# EAGLE design Controller_daughter (EAGLE 7.7.0)
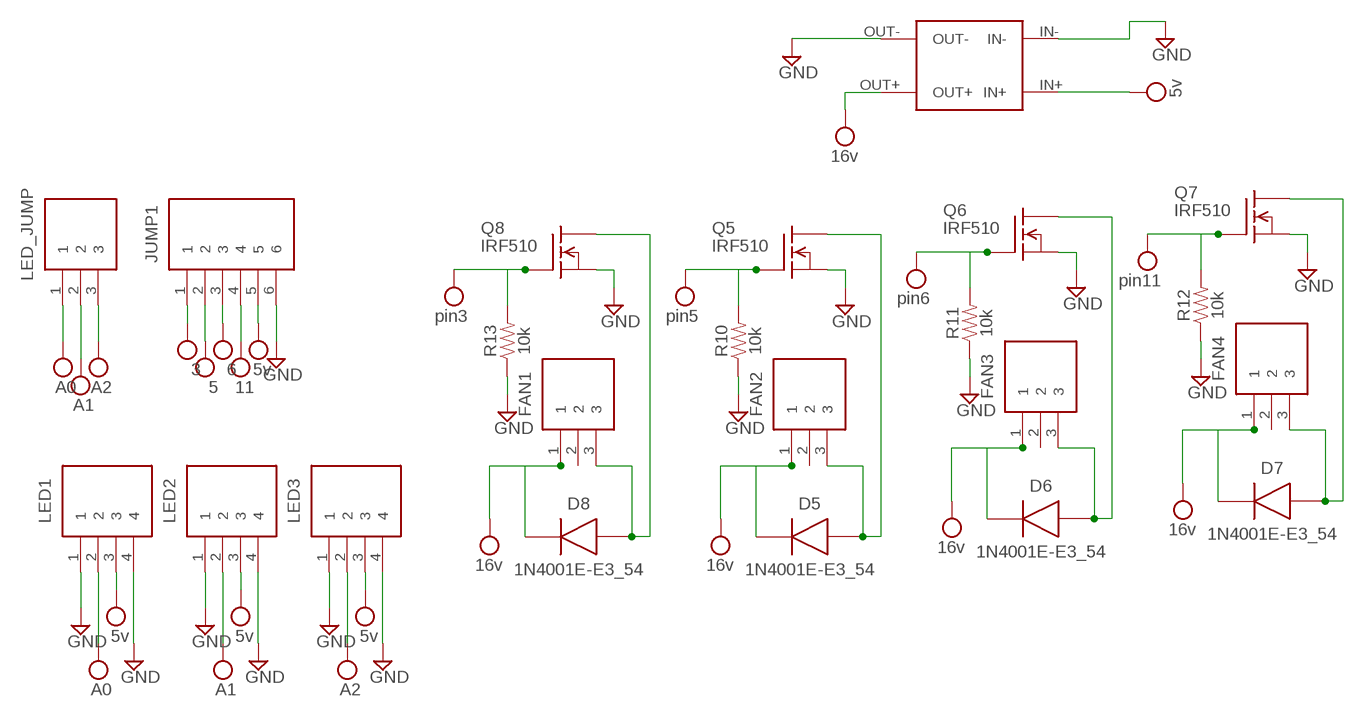
[diagram p0: schematic, sheet 1]

## Parts
D5  1N4001E-E3_54  [DIOAD1405W86L465D235]
D6  1N4001E-E3_54  [DIOAD1405W86L465D235]
D7  1N4001E-E3_54  [DIOAD1405W86L465D235]
D8  1N4001E-E3_54  [DIOAD1405W86L465D235]
FAN1  S3B-XH-A(LF)(SN)  [SHDR3W80P0X250_1X3_990X610X700]
FAN2  S3B-XH-A(LF)(SN)  [SHDR3W80P0X250_1X3_990X610X700]
FAN3  S3B-XH-A(LF)(SN)  [SHDR3W80P0X250_1X3_990X610X700]
FAN4  S3B-XH-A(LF)(SN)  [SHDR3W80P0X250_1X3_990X610X700]
JUMP1  S6B-XH-A(LF)(SN)  [SHDR6W64P0X250_1X6_1740X1155X7]
LED1  S4B-XH-A(LF)(SN)  [SHDR4W64P0X250_1X4_1240X1155X7]
LED2  S4B-XH-A(LF)(SN)  [SHDR4W64P0X250_1X4_1240X1155X7]
LED3  S4B-XH-A(LF)(SN)  [SHDR4W64P0X250_1X4_1240X1155X7]
LED_JUMP  S3B-XH-A(LF)(SN)  [SHDR3W80P0X250_1X3_990X610X700]
Q5  IRF510  [TO220]
Q6  IRF510  [TO220]
Q7  IRF510  [TO220]
Q8  IRF510  [TO220]
R10  10k  10KOHM-HORIZ-1/4W-5%  [AXIAL-0.3]
R11  10k  10KOHM-HORIZ-1/4W-5%  [AXIAL-0.3]
R12  10k  10KOHM-HORIZ-1/4W-5%  [AXIAL-0.3]
R13  10k  10KOHM-HORIZ-1/4W-5%  [AXIAL-0.3]
U$2  CN6009THROUGH_HOLE  [CN6009]

## Nets
5V_EXT: JUMP1.5 LED1.3 LED2.3 LED3.3 U$2.IN+ ; supply symbol labelled 5v
16V: D5.2(K) D6.2(K) D7.2(K) D8.2(K) FAN1.1 FAN2.1 FAN3.1 FAN4.1 U$2.OUT+ ; supply symbol labelled 16v
GND: JUMP1.6 LED1.1 LED1.4 LED2.1 LED2.4 LED3.1 LED3.4 U$2.IN-
GND_16: Q5.3(S) Q6.3(S) Q7.3(S) Q8.3(S) R10.P$1 R11.P$1 R12.P$1 R13.P$1 U$2.OUT- ; supply symbol labelled GND
N$5: D5.1(A) FAN2.3 Q5.2(D)
N$6: D6.1(A) FAN3.3 Q6.2(D)
N$7: D7.1(A) FAN4.3 Q7.2(D)
N$8: D8.1(A) FAN1.3 Q8.2(D)
PIN3: JUMP1.1 Q8.1(G) R13.P$2 ; supply symbol labelled pin3, 3
PIN5: JUMP1.2 Q5.1(G) R10.P$2 ; supply symbol labelled pin5, 5
PIN6: JUMP1.3 Q6.1(G) R11.P$2 ; supply symbol labelled pin6, 6
PIN11: JUMP1.4 Q7.1(G) R12.P$2 ; supply symbol labelled pin11, 11
PIN_A0: LED1.2 LED_JUMP.1 ; supply symbol labelled A0
PIN_A1: LED2.2 LED_JUMP.2 ; supply symbol labelled A1
PIN_A2: LED3.2 LED_JUMP.3 ; supply symbol labelled A2
Unconnected: FAN1.2 FAN2.2 FAN3.2 FAN4.2

## Library data of the parts
D5-D8 = SamacSys_Parts:1N4001E-E3_54: Rectifiers Vr/50V Io/1A <https://componentsearchengine.com/Images/1/1N4001E-E3_54.jpg> Source: Datasheet <http://www.vishay.com/docs/88503/1n4001.pdf>; DESCRIPTION: Rectifiers Vr/50V Io/1A; HEIGHT: mm; MANUFACTURER_NAME: Vishay; MANUFACTURER_PART_NUMBER: 1N4001E-E3/54; SUPPLIER_NAME: RS
FAN1-FAN4 LED_JUMP = SamacSys_Parts:S3B-XH-A(LF)(SN): XH-2.5mm Header side entry 3 way JST XH Series, Series Number S3B, 2.5mm Pitch 3 Way 1 Row Right Angle PCB Header, Solder Termination, 3A <https://componentsearchengine.com/Images/3/S3B-XH-A%28LF%29%28SN%29.jpg> Source: Datasheet <http://www.jst-mfg.com/product/pdf/eng/eXH.pdf>; DESCRIPTION: XH-2.5mm Header side entry 3 way JST XH Series, Series Number S3B, 2.5mm Pitch 3 Way 1 Row Right Angle PCB Header, Solder Termination, 3A; HEIGHT: 7mm; MANUFACTURER_NAME: JST (JAPAN SOLDERLESS TERMINALS); MANUFACTURER_PART_NUMBER: S3B-XH-A(LF)(SN); RS_PART_NUMBER: 8201585; SUPPLIER_NAME: RS
JUMP1 = SamacSys_Parts:S6B-XH-A(LF)(SN): XH-2.5mm Header side entry 6 way JST XH Series, Series Number S6B, 2.5mm Pitch 6 Way 1 Row Right Angle PCB Header, Solder Termination, 3A <https://componentsearchengine.com/Images/3/S6B-XH-A%28LF%29%28SN%29.jpg> Source: Datasheet <http://www.jst-mfg.com/product/pdf/eng/eXH.pdf>; DESCRIPTION: XH-2.5mm Header side entry 6 way JST XH Series, Series Number S6B, 2.5mm Pitch 6 Way 1 Row Right Angle PCB Header, Solder Termination, 3A; HEIGHT: 7mm; MANUFACTURER_NAME: JST (JAPAN SOLDERLESS TERMINALS); MANUFACTURER_PART_NUMBER: S6B-XH-A(LF)(SN); RS_PART_NUMBER: 8201591; SUPPLIER_NAME: RS
LED1-LED3 = SamacSys_Parts:S4B-XH-A(LF)(SN): XH-2.5mm Header side entry 4 way JST XH Series, Series Number S4B, 2.5mm Pitch 4 Way 1 Row Right Angle PCB Header, Solder Termination, 3A <https://componentsearchengine.com/Images/3/S4B-XH-A%28LF%29%28SN%29.jpg> Source: Datasheet <http://www.jst-mfg.com/product/pdf/eng/eXH.pdf>; DESCRIPTION: XH-2.5mm Header side entry 4 way JST XH Series, Series Number S4B, 2.5mm Pitch 4 Way 1 Row Right Angle PCB Header, Solder Termination, 3A; HEIGHT: 7mm; MANUFACTURER_NAME: JST (JAPAN SOLDERLESS TERMINALS); MANUFACTURER_PART_NUMBER: S4B-XH-A(LF)(SN); RS_PART_NUMBER: 8201589; SUPPLIER_NAME: RS
Q5-Q8 = transistor-fet:IRF510: N-Channel Enhancement MOSFET (HEXFET); 100V; 5,6A; 0,54Ohm
R10-R13 = SparkFun-Resistors:10KOHM: 10kΩ resistor A resistor is a passive two-terminal electrical component that implements electrical resistance as a circuit element. Resistors act to reduce current flow, and, at the same time, act to lower voltage levels within circuits. - Wikipedia; PROD_ID: RES-09435
U$2 = CN6009:CN6009

## Board
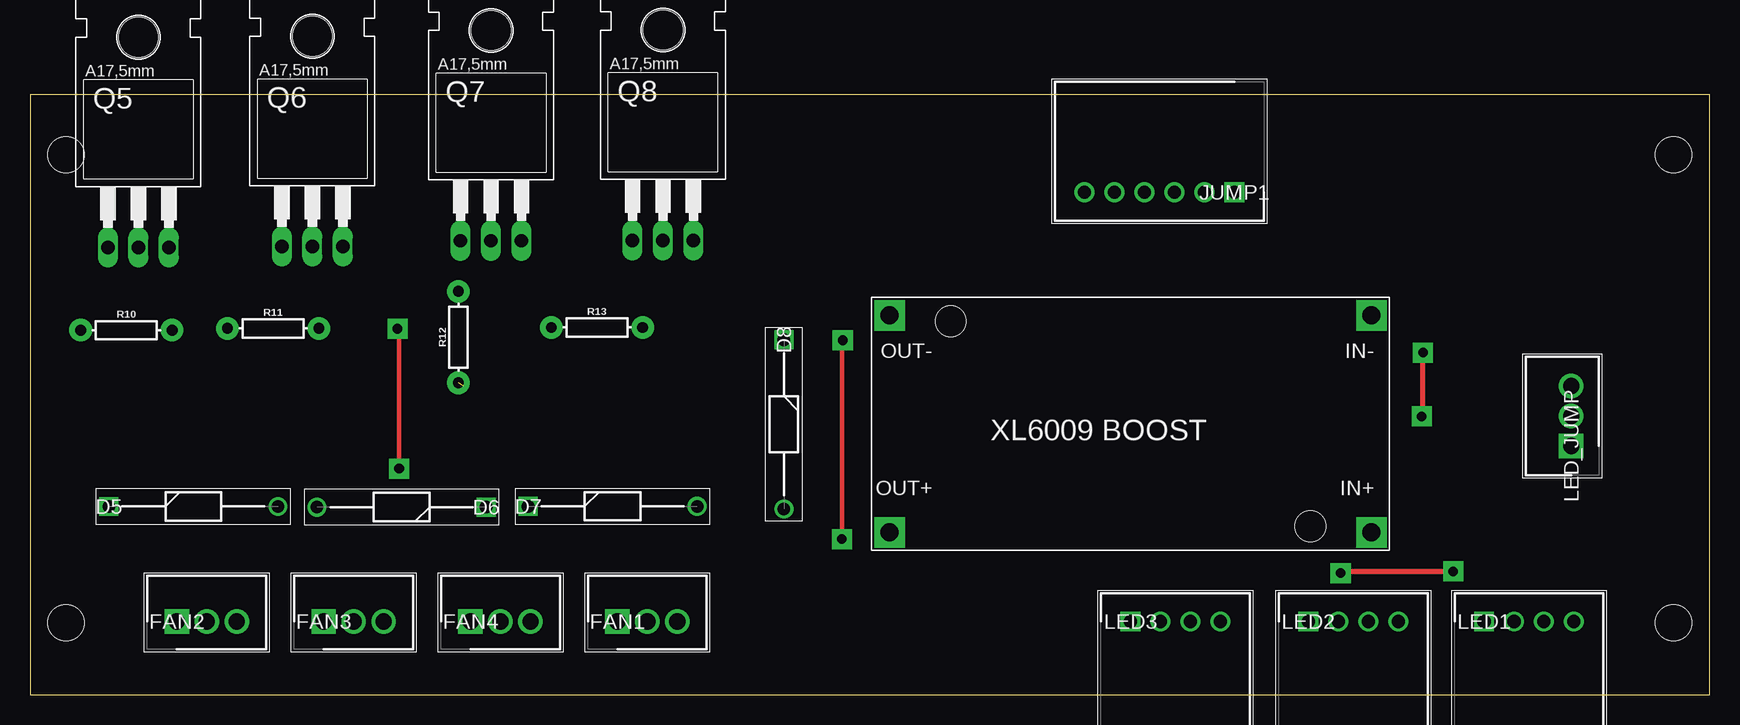
[diagram p1: board, top side]
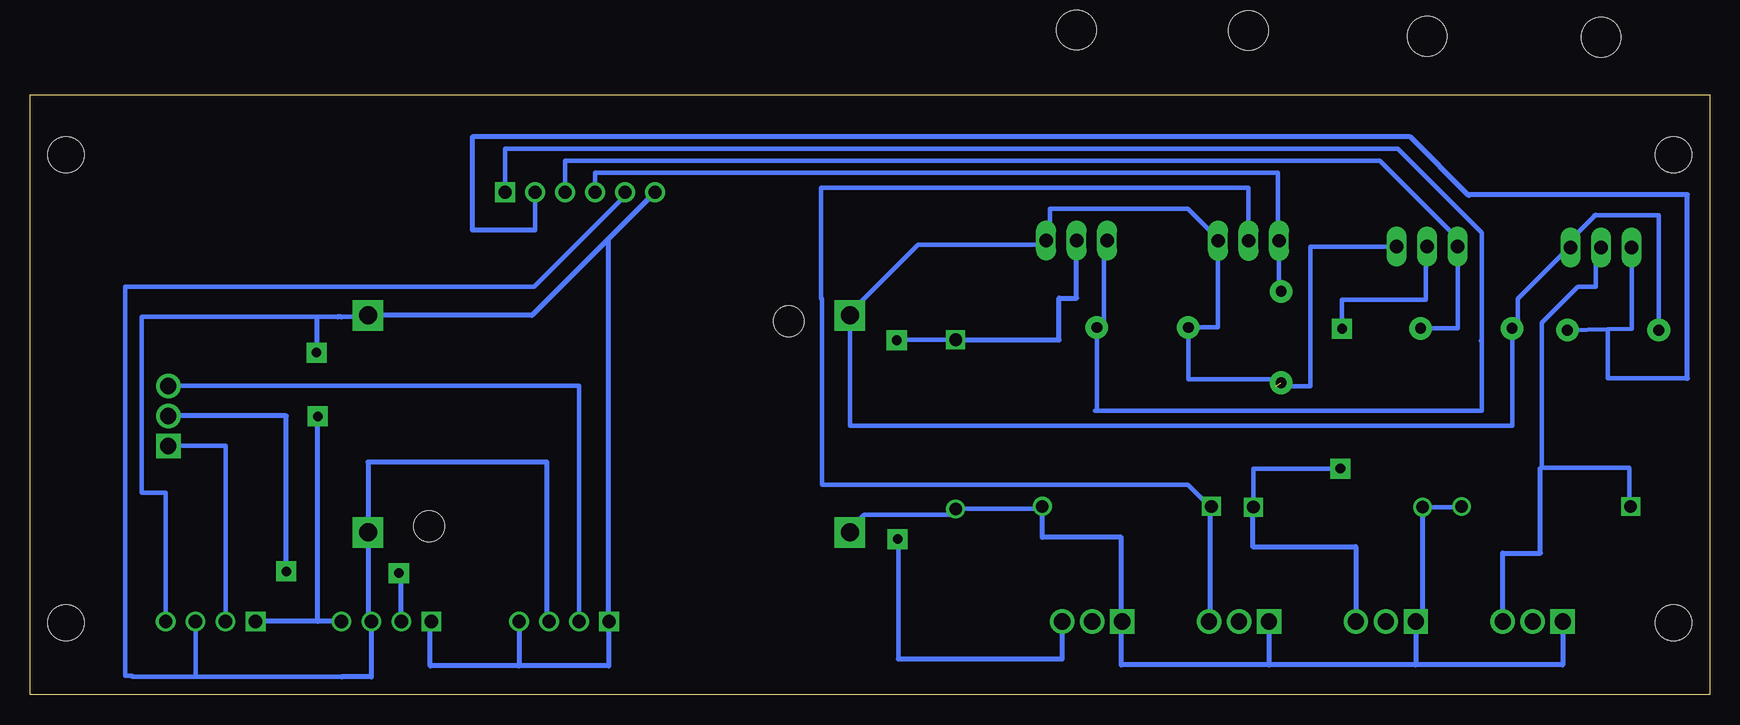
[diagram p2: board, bottom side, seen from below]

Size 140 x 50 mm. Coordinates in mm from the lower left corner, seen from the top.
Outline: 0,0 140,0 140,50 0,50 0,0
Copper layers (1*16): Top 0.035mm / dielectric 1.5mm / Bottom 0.035mm
Design rules "CNC_0.4mm *": minimum track width 15mil, minimum drill 24mil, track to track 20mil, track to pad 20mil, pad to pad 8mil, via to via 8mil, smd to smd 8mil, copper to edge 30mil, drill to drill 8mil, minimum pad ring 10mil, minimum via ring 8mil, stop-mask expansion 4mil, vias tented up to drill 0mil, thermal gap 10mil
Holes 3 mm at 3,6 137,6 137,45 3,45

### Footprints (pad centres in the part's own frame; a part is rotated, then mirrored left to right if it is on the bottom)
DIOAD1405W86L465D235 = drill 1.05 pad 1.575 square: 1 0,0 | drill 1.05 pad 1.575: 2 14.1,0
SHDR3W80P0X250_1X3_990X610X700 = drill 1.35 pad 2.025 square: 1 0,0 | drill 1.35 pad 2.025: 2 2.5,0; 3 5,0
SHDR6W64P0X250_1X6_1740X1155X7 = drill 1.1 pad 1.65 square: 1 0,0 | drill 1.1 pad 1.65: 2 2.5,0; 3 5,0; 4 7.5,0; 5 10,0; 6 12.5,0
SHDR4W64P0X250_1X4_1240X1155X7 = drill 1.1 pad 1.65 square: 1 0,0 | drill 1.1 pad 1.65: 2 2.5,0; 3 5,0; 4 7.5,0
TO220 = drill 1.118 long: 1 -2.54,-6.35; 2 0,-6.35; 3 2.54,-6.35 | hole 3.302: 0,11.176
AXIAL-0.3 = drill 0.9 pad 1.88: P$1 -3.81,0; P$2 3.81,0
CN6009 = drill 1.5 pad 2.54 square: IN+ 1.5,19.582; IN- 1.5,1.5; OUT+ 41.68,19.582; OUT- 41.68,1.5 | hole 2.54: 6.604,19.082; 36.576,2

### Placement (x,y rotation side)
D5  6.57,15.7 0 top
D6  38.02,15.65 180 top
D7  41.52,15.71 0 top
D8  62.84,29.59 270 top
FAN1  48.96,6.12 0 top
FAN2  12.24,6.12 0 top
FAN3  24.48,6.12 0 top
FAN4  36.72,6.12 0 top
JUMP1  100.4,41.88 180 top
LED1  121.2,6.12 0 top
LED2  106.55,6.12 0 top
LED3  91.74,6.12 0 top
LED_JUMP  128.47,20.74 90 top
Q5  9.04,43.63 0 top
Q6  23.54,43.7 0 top
Q7  38.43,44.19 0 top
Q8  52.76,44.23 0 top
R10  8.04,30.39 0 top
R11  20.27,30.54 0 top
R12  35.71,29.82 90 top
R13  47.26,30.62 0 top
U$2  113.33,33.13 180 top

### Tracks (layer width: path | path; a pad name or v marks a point on that pad's centre or on a via)
5V_EXT
  Bottom 0.381: JUMP1.5 90.5,41.5 98,34 132.05,34 132.05,1.59 131.5,1.59 131.5,1.5 126.2,1.5 | 126.2,1.5 114.01,1.5 113.5,1.5 | LED1.3 126.2,1.5
  Bottom 0.406: LED3.3 96.9,6.12 96.9,19.4 111.83,19.4 U$2.IN+ 111.83,6.12 LED2.3 111.55,1.5 114.01,1.5
16V
  Bottom 0.381: U$2.OUT+ 71.5,14 70.5,15 63,15 D8.2 62.5,15.5 56,15.5 D7.2 | D6.2 20.72,15.65 D5.2
  Bottom 0.406: 55.66,15.71 D7.2 55.62,13.12 49.04,13.12 49.04,6.12 | 24.48,2.49 FAN3.1 23.92,6.12 D6.2 | 24.48,2.49 36.72,2.49 | 36.72,2.49 49.04,2.49 49.04,6.12 | 49.04,6.12 FAN1.1 | FAN4.1 36.72,2.49 | FAN2.1 12.24,2.49 24.48,2.49
GND  (via drill 0.8 pad 1.68)
  Top 0.406: v116.02,23.21 116.11,23.21 v116.11,28.52
  Bottom 0.381: U$2.IN- 112,31.5 114.35,31.5 116.05,31.5 130.67,31.5 130.67,16.84 128.7,16.84 LED1.4
  Bottom 0.406: JUMP1.6 91.77,38.02 | 91.77,38.02 98.15,31.63 U$2.IN- | LED3.1 91.77,6.14 | 91.77,6.14 91.77,38.02 | 91.77,6.14 91.77,2.42 99.24,2.42 | 99.24,2.42 106.63,2.42 106.63,6.12 LED2.1 | LED3.4 99.24,2.42 | 114.05,31.5 114.35,31.5 | LED1.1 LED2.4 116.02,6.12 v116.02,23.21 | v116.11,28.52 116.05,28.52 116.05,31.5
GND_16  (1 unrouted)
  Bottom 0.381: 9.6,39.91 12,37.5 Q5.3 12,37 16,33 16,31 R11.P$1 16.42,30.54 16.42,22.41 71.65,22.41 U$2.OUT- 71.5,32 66,37.5 55.5,37.5 Q8.3 55,38 55,40.5 43.5,40.5 41,38 Q7.3 40.97,30.62 R13.P$1 43.45,26.29 36.16,26.29 36.16,25.73 33.26,25.73 33.26,37.35 Q6.3 | 9.6,39.91 9.5,40 | R10.P$1 4.21,30.39 4.21,39.97 9.6,39.97 9.6,39.91
N$5
  Bottom 0.381: 6.5,16 D5.1 6.69,15.7 6.69,18.92 14,18.92 14,31 11,34 9.5,34 9.5,37 Q5.2
  Bottom 0.406: FAN2.3 17.24,11.81 14.09,11.81 14.09,18.92 14,18.92
N$6  (via drill 0.8 pad 1.68)
  Top 0.381: v30.77,18.85 30.77,30.51 v30.63,30.51
  Bottom 0.381: 38.08,15.65 D6.1 38.02,18.85 v30.77,18.85 | v30.63,30.51 30.63,32.93 23.66,32.93 23.66,37.35 Q6.2
  Bottom 0.406: D6.1 38.07,15.65 38.07,12.36 29.48,12.36 FAN3.3
N$7
  Bottom 0.381: D7.1 42,16 43.5,17.5 74,17.5 74,33 74.07,33 74.07,42.25 38.43,42.25 Q7.2
  Bottom 0.406: 41.73,15.71 41.63,15.71 | 41.63,15.71 D7.1 | 41.63,15.71 41.63,6.12 FAN4.3
N$8  (via drill 0.8 pad 1.68)
  Top 0.381: v67.68,12.98 67.68,29.55 v67.75,29.55
  Bottom 0.381: 67.61,2.97 67.61,12.98 v67.68,12.98 | v67.75,29.55 67.75,29.59 D8.1
  Bottom 0.406: FAN1.3 53.96,2.97 67.61,2.97 | D8.1 54.22,29.59 54.22,33.06 52.76,33.06 Q8.2
PIN3
  Bottom 0.381: 19,29.5 19,38.5 26,45.5 100.4,45.5 JUMP1.1 | 51,30.5 R13.P$2 | Q8.1 50.5,37.5 50.5,31 51,31 R13.P$2 | 19,29.5 19.05,29.5 | 51.07,23.66 19,23.66 19,29.5 | 51.21,23.66 51.07,23.66 | 51.07,23.66 R13.P$2
PIN5
  Bottom 0.381: JUMP1.2 97.9,38.73 | R10.P$2 8.49,30.48 | 8.49,30.48 6.5,30.53 Q5.1 | 1.93,26.37 8.49,26.37 8.49,30.48
  Bottom 0.406: 1.93,26.37 1.84,26.37 1.84,41.69 20.06,41.69 20.06,41.6 24.96,46.5 103.12,46.5 103.12,38.73 97.9,38.73
PIN6
  Bottom 0.381: R11.P$2 21,30.54 Q6.1 21,38 27.5,44.5 95.4,44.5 JUMP1.3
PIN11
  Bottom 0.381: R12.P$2 35.89,33.63 Q7.1 36,38 36,43.5 92.9,43.5 JUMP1.4
PIN_A0
  Bottom 0.381: LED1.2 123.7,20.74 LED_JUMP.1
PIN_A1  (via drill 0.8 pad 1.68)
  Top 0.406: v109.25,10.15 109.25,10.29 v118.63,10.29
  Bottom 0.406: LED2.2 109.05,10.15 v109.25,10.15 | v118.63,10.29 118.63,23.24 LED_JUMP.2
PIN_A2
  Bottom 0.381: LED3.2 94.24,25.74 LED_JUMP.3